# Altium project 开发板.PrjPcb
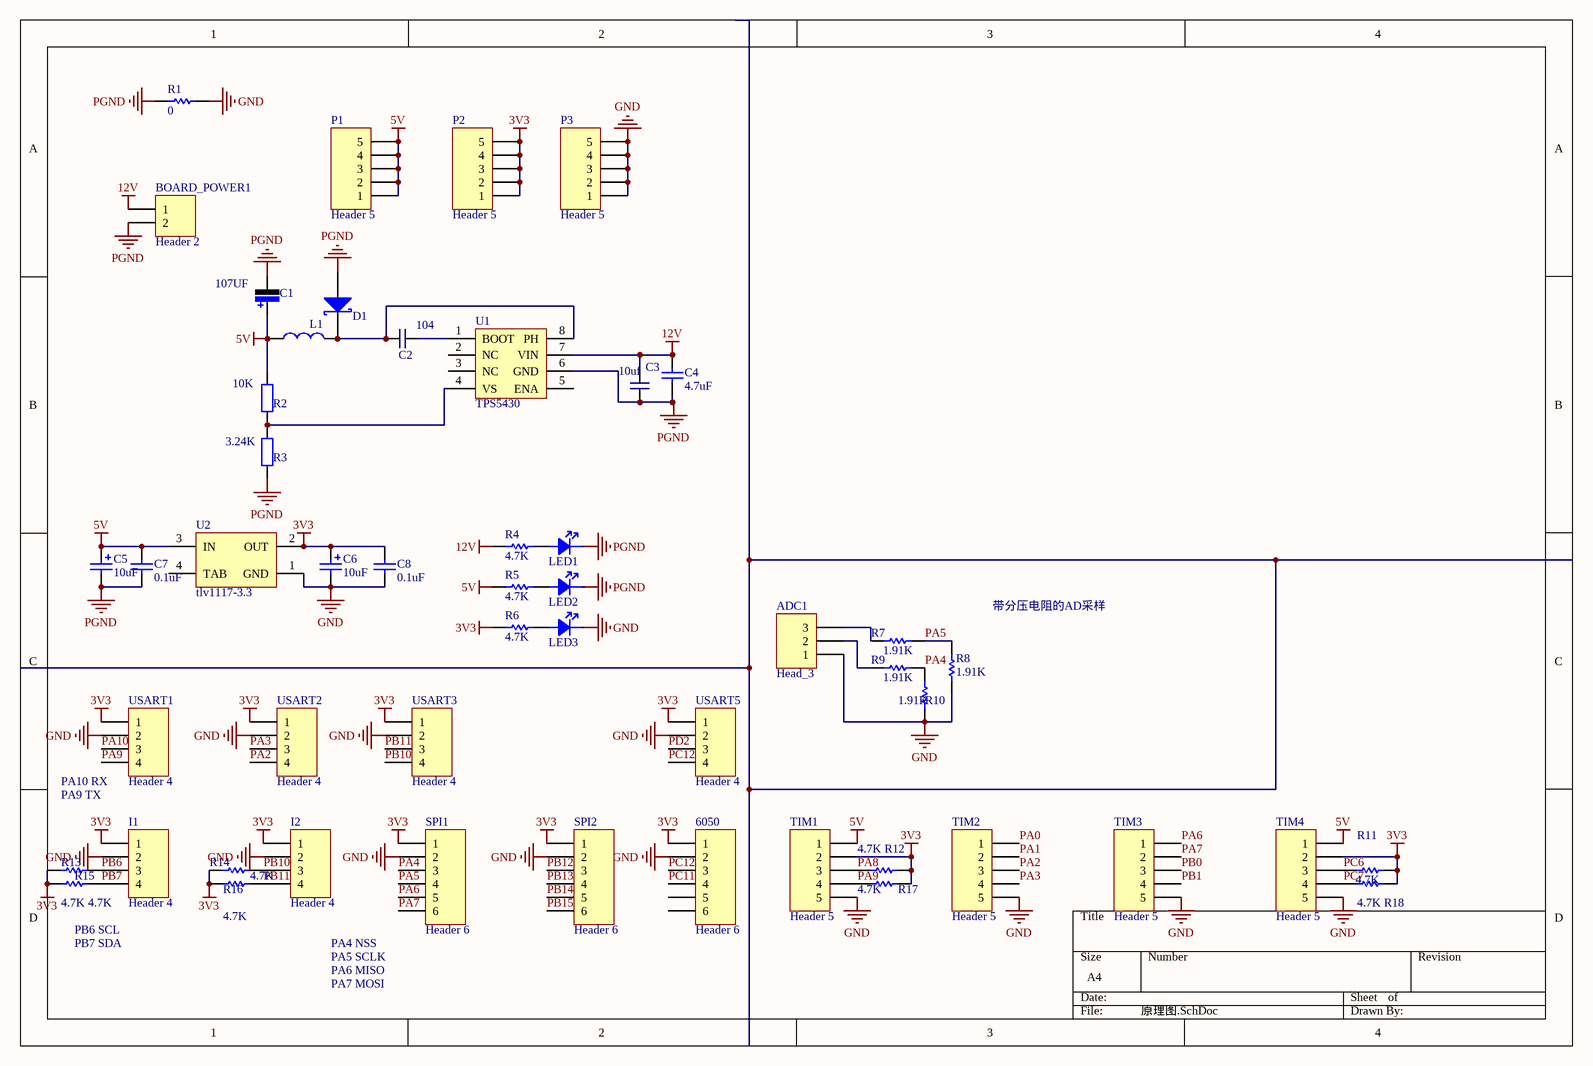
[diagram p0: 原理图.SchDoc]
2 sheets, 71 parts. Net scope: global (net labels, ports and power ports of the same name join across sheets).
Board file: PCB.PcbDoc
Sheets:
  原理图.SchDoc
  最小系统.SchDoc

## Sheet 原理图.SchDoc
size A4

### Parts
6050  Header 6  [HDR1X6- duplicate]
ADC1  Head_3  [HDR1X3]
BOARD_POWER1  Header 2  [Green_2P]
C1  107UF  [6032C  TA]
C2  104  [0603- C]
C3  10uf  [0805C]
C4  value 4.7uF  [CAP-MLCC-0603]  (hidden comment: Cap)
C5  value 10uF  [6032C]  (hidden comment: Cap Pol1)
C6  value 10uF  [6032C]  (hidden comment: Cap Pol1)
C7  value 0.1uF  [CAP-MLCC-0603]  (hidden comment: Cap)
C8  value 0.1uF  [CAP-MLCC-0603]  (hidden comment: Cap)
D1  D  [D RS1M]  (value not drawn)
I1  Header 4  [HDR1X4]
I2  Header 4  [HDR1X4]
L1  L  [CD_54]  (value not drawn)
LED1  lED  [0805D]  (value not drawn)
LED2  lED  [0805D]  (value not drawn)
LED3  lED  [0805D]  (value not drawn)
P1  Header 5  [HDR1X5]
P2  Header 5  [HDR1X5]
P3  Header 5  [HDR1X5]
R1  value 0  [RES-0603]  (hidden comment: Res1)
R2  10K  [0603-R]
R3  3.24K  [0603-R]
R4  value 4.7K  [RES-0603]  (hidden comment: Res1)
R5  value 4.7K  [RES-0603]  (hidden comment: Res1)
R6  value 4.7K  [RES-0603]  (hidden comment: Res1)
R7  value 1.91K  [RES-0603]  (hidden comment: Res1)
R8  value 1.91K  [RES-0603]  (hidden comment: Res1)
R9  value 1.91K  [RES-0603]  (hidden comment: Res1)
R10  value 1.91K  [RES-0603]  (hidden comment: Res1)
R11  value 4.7K  [RES-0603]  (hidden comment: Res1)
R12  value 4.7K  [RES-0603]  (hidden comment: Res1)
R13  value 4.7K  [RES-0603]  (hidden comment: Res1)
R14  value 4.7K  [RES-0603]  (hidden comment: Res1)
R15  value 4.7K  [RES-0603]  (hidden comment: Res1)
R16  value 4.7K  [RES-0603]  (hidden comment: Res1)
R17  value 4.7K  [RES-0603]  (hidden comment: Res1)
R18  value 4.7K  [RES-0603]  (hidden comment: Res1)
SPI1  Header 6  [HDR1X6]
SPI2  Header 6  [HDR1X6]
TIM1  Header 5  [HDR1X5]
TIM2  Header 5  [HDR1X5]
TIM3  Header 5  [HDR1X5]
TIM4  Header 5  [HDR1X5]
U1  TPS5430  [SOIC-8piN]
U2  tlv1117-3.3  [LM1117]
USART1  Header 4  [HDR1X4]
USART2  Header 4  [HDR1X4]
USART3  Header 4  [HDR1X4]
USART5  Header 4  [HDR1X4]

### Nets
3V3: 6050.1 C6.1 C8.2 I1.1 I2.1 P2.1 P2.2 P2.3 P2.4 P2.5 R6.2 R11.1 R12.1 R13.2 R14.2 R15.2 R16.2 R17.1 R18.1 SPI1.1 SPI2.1 TIM1.2 TIM4.2 U2.2(OUT) USART1.1 USART2.1 USART3.1 USART5.1
5V: C1.1 C5.1 C7.2 L1.2 P1.1 P1.2 P1.3 P1.4 P1.5 R2.2 R5.2 TIM1.1 TIM4.1 U2.3(IN)
12V: BOARD_POWER1.1 C3.2 C4.2 R4.2 U1.7(VIN)
GND: 6050.2 ADC1.1 C6.2 C8.1 I1.2 I2.2 LED3.K P3.1 P3.2 P3.3 P3.4 P3.5 R1.2 R8.2 R10.2 SPI1.2 SPI2.2 TIM1.5 TIM2.5 TIM3.5 TIM4.5 U2.1(GND) USART1.2 USART2.2 USART3.2 USART5.2
PGND: BOARD_POWER1.2 C1.2 C3.1 C4.1 C5.2 C7.1 D1.A LED1.K LED2.K R1.1 R3.2 U1.6(GND)
PA0: TIM2.1
PA1: TIM2.2
PA2: TIM2.3 USART2.4
PA3: TIM2.4 USART2.3
PA4: R9.1 R10.1 SPI1.3
PA5: R7.1 R8.1 SPI1.4
PA6: SPI1.5 TIM3.1
PA7: SPI1.6 TIM3.2
PA8: R12.2 TIM1.3
PA9: R17.2 TIM1.4 USART1.4
PA10: USART1.3
PB0: TIM3.3
PB1: TIM3.4
PB6: I1.3 R13.1
PB7: I1.4 R15.1
PB10: I2.3 R14.1 USART3.4
PB11: I2.4 R16.1 USART3.3
PB12: SPI2.3
PB13: SPI2.4
PB14: SPI2.5
PB15: SPI2.6
PC6: R11.2 TIM4.3
PC7: R18.2 TIM4.4
PC11: 6050.4
PC12: 6050.3 USART5.4
PD2: USART5.3
NetADC1_2: ADC1.2 R9.2
NetADC1_3: ADC1.3 R7.2
NetC2_1: C2.1 U1.1(BOOT)
NetC2_2: C2.2 D1.K L1.1 U1.8(PH)
NetLED1_A: LED1.A R4.1
NetLED2_A: LED2.A R5.1
NetLED3_A: LED3.A R6.1
NetR2_1: R2.1 R3.1 U1.4(VS)

Not connected (* = marked no-connect by the designer): 6050 5 6; U1 2(NC) 3(NC) 5(ENA); U2 4(TAB)

### Notes on the sheet
- 带分压电阻的AD采样
- (near USART1) PA10 RX
- PA9 TX
- PB6 SCL
- PB7 SDA
- PA4 NSS
- PA5 SCLK
- PA6 MISO
- PA7 MOSI

### Library data of the parts
6050 = Header 6: 接插件; LatestRevisionDate: 17-Jul-2002; LatestRevisionNote: Re-released for DXP Platform.; Publisher: Altium Limited
BOARD_POWER1 = Header 2: Header, 2-Pin; LatestRevisionDate: 17-Jul-2002; LatestRevisionNote: Re-released for DXP Platform.; Publisher: Altium Limited
C1 = Cap_2: 钽电容
C2 C3 = Cap
C4 C7 C8 = Cap: Capacitor; Published: 8-Jun-2000; LatestRevisionDate: 17-Jul-2002; LatestRevisionNote: Re-released for DXP Platform.; PackageReference: RAD-0.3; Publisher: Altium Limited
C5 C6 = Cap Pol1: Polarized Capacitor (Radial); Published: 8-Jun-2000; LatestRevisionDate: 17-Jul-2002; LatestRevisionNote: Re-released for DXP Platform.; PackageReference: RB7.6-15; Publisher: Altium Limited
I1 I2 USART1-USART3 USART5 = Header 4: Header, 4-Pin; LatestRevisionDate: 17-Jul-2002; LatestRevisionNote: Re-released for DXP Platform.; Publisher: Altium Limited
L1 = L: 电感
LED1-LED3 = 00-D-LED
P1-P3 TIM1-TIM4 = Header 5: Header, 5-Pin; LatestRevisionDate: 17-Jul-2002; LatestRevisionNote: Re-released for DXP Platform.; Publisher: Altium Limited
R1 R4-R18 = Res1: Resistor; Published: 8-Jun-2000; LatestRevisionDate: 17-Jul-2002; LatestRevisionNote: Re-released for DXP Platform.; PackageReference: AXIAL-0.3; Publisher: Altium Limited
R2 R3 = R
SPI1 SPI2 = Header 6: Header, 6-Pin; LatestRevisionDate: 17-Jul-2002; LatestRevisionNote: Re-released for DXP Platform.; Publisher: Altium Limited
U2 = LM1117IMP-5.0: 800mA Low-Dropout Linear Regulator; Manufacturer: National Semiconductor; CompType: LDO IC; PackageTopMarking: XYTT*N06B; PowerWise: N; Published: 4-Dec-2008; DatasheetVersion: Apr-2006; PackageVersion: revB, Apr-2003; PackageReference: MP04A; Publisher: Altium Limited; PackageDescription: Molded SOT-223, 6.50 x 3.56 x 1.6mm Body, 4 Lead, 2.3mm Pitch; PartNumber: LM1117IMP-5.0; RoHS: O; PinCount: 4; DigiKeyPartNumber: LM1117IMP-5.0CT-ND; Code_JEDEC: TO-261-AA; Code_IPC: SOT223-4; ComponentLink1Description: LM1117 Datasheet; ComponentLink1URL: http://www.national.com/ds/LM/LM1117.pdf; ComponentLink2Description: LM1117 Web Page; ComponentLink2URL: http://www.national.com/pf/LM/LM1117.html; ComponentLink3Description: MP04A Package Page; ComponentLink3URL: http://www.national.com/packaging/folders/mp04a.html

## Sheet 最小系统.SchDoc
size A4
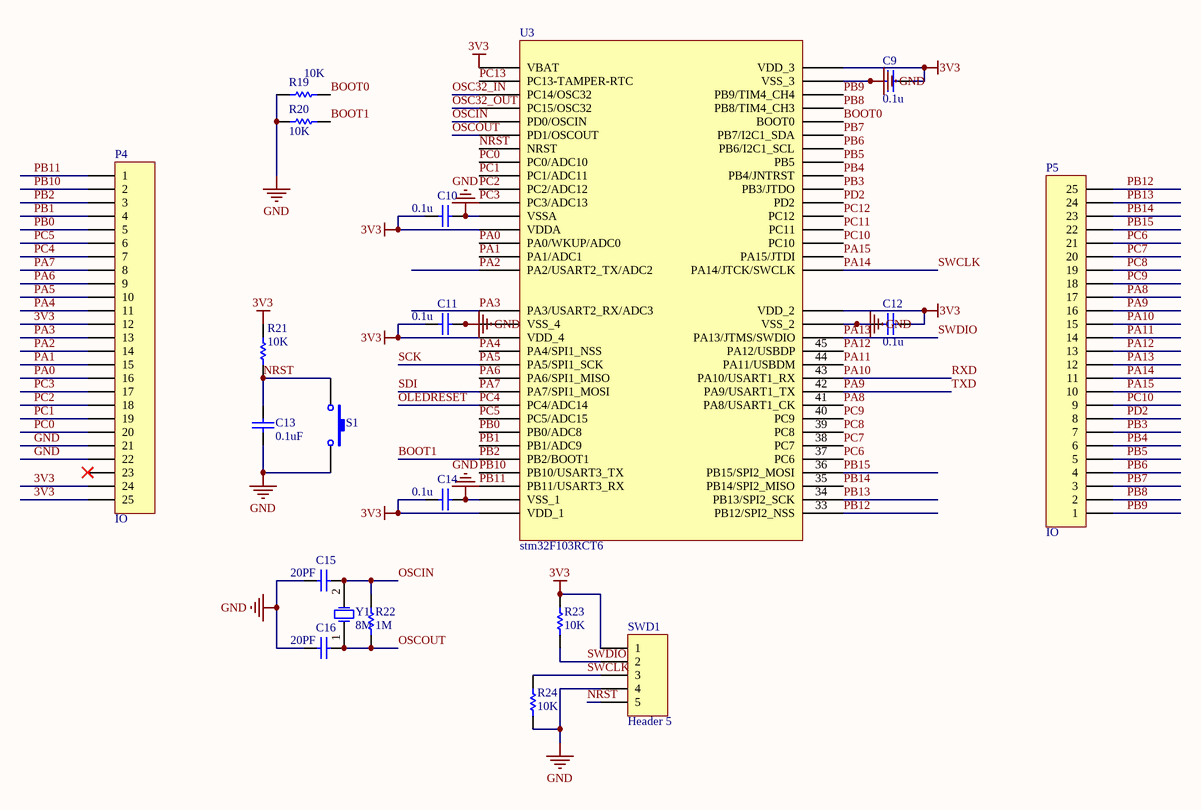
[diagram p1: 最小系统.SchDoc]

### Parts
C9  value 0.1u  [CAP-MLCC-0603]  (hidden comment: Cap)
C10  value 0.1u  [CAP-MLCC-0603]  (hidden comment: Cap)
C11  value 0.1u  [CAP-MLCC-0603]  (hidden comment: Cap)
C12  value 0.1u  [CAP-MLCC-0603]  (hidden comment: Cap)
C13  value 0.1uF  [CAP-MLCC-0603]  (hidden comment: Cap)
C14  value 0.1u  [CAP-MLCC-0603]  (hidden comment: Cap)
C15  value 20PF  [CAP-MLCC-0603]  (hidden comment: Cap)
C16  value 20PF  [CAP-MLCC-0603]  (hidden comment: Cap)
P4  IO  [Header 25]
P5  IO  [Header 25]
R19  value 10K  [RES-0603]  (hidden comment: Res1)
R20  value 10K  [RES-0603]  (hidden comment: Res1)
R21  value 10K  [RES-0603]  (hidden comment: Res1)
R22  value 1M  [RES-0603]  (hidden comment: Res1)
R23  value 10K  [RES-0603]  (hidden comment: Res1)
R24  value 10K  [RES-0603]  (hidden comment: Res1)
S1  SW-PB  [key - duplicate]  (value not drawn)
SWD1  Header 5  [HDR1X5]
U3  stm32F103RCT6  [STM32F103RCT6]
Y1  8M  [Osc-6032]

### Nets
3V3: C9.1 C10.1 C11.1 C12.1 C14.1 P4.12 P4.24 P4.25 R21.2 R23.2 SWD1.1 U3.1(VBAT) U3.13(VDDA) U3.19(VDD_4) U3.32(VDD_1) U3.48(VDD_2) U3.64(VDD_3)
GND: C9.2 C10.2 C11.2 C12.2 C13.2 C14.2 C15.1 C16.1 P4.21 P4.22 R19.2 R20.2 R24.2 S1.2 SWD1.4 U3.12(VSSA) U3.18(VSS_4) U3.31(VSS_1) U3.47(VSS_2) U3.63(VSS_3)
BOOT0: R19.1 U3.60(BOOT0)
BOOT1: P4.3 R20.1 U3.28(PB2/BOOT1)  [also labelled PB2]
NRST: C13.1 R21.1 S1.1 SWD1.5 U3.7(NRST)
OLEDRESET: P4.7 U3.24(PC4/ADC14)  [also labelled PC4]
OSC32_IN: U3.3(PC14/OSC32)
OSC32_OUT: U3.4(PC15/OSC32)
OSCIN: C15.2 R22.2 U3.5(PD0/OSCIN) Y1.2(OSC2)
OSCOUT: C16.2 R22.1 U3.6(PD1/OSCOUT) Y1.1(OSC1)
PA0: P4.16 U3.14(PA0/WKUP/ADC0)
PA1: P4.15 U3.15(PA1/ADC1)
PA2: P4.14 U3.16(PA2/USART2_TX/ADC2)
PA3: P4.13 U3.17(PA3/USART2_RX/ADC3)
PA4: P4.11 U3.20(PA4/SPI1_NSS)
PA5: P4.10 U3.21(PA5/SPI1_SCK)  [also labelled SCK]
PA6: P4.9 U3.22(PA6/SPI1_MISO)
PA7: P4.8 U3.23(PA7/SPI1_MOSI)  [also labelled SDI]
PA8: P5.17 U3.41(PA8/USART1_CK)
PA9: P5.16 U3.42(PA9/USART1_TX)  [also labelled TXD]
PA10: P5.15 U3.43(PA10/USART1_RX)  [also labelled RXD]
PA11: P5.14 U3.44(PA11/USBDM)
PA12: P5.13 U3.45(PA12/USBDP)
PA13: P5.12 R23.1 SWD1.2 U3.46(PA13/JTMS/SWDIO)  [also labelled SWDIO]
PA14: P5.11 R24.1 SWD1.3 U3.49(PA14/JTCK/SWCLK)  [also labelled SWCLK]
PA15: P5.10 U3.50(PA15/JTDI)
PB0: P4.5 U3.26(PB0/ADC8)
PB1: P4.4 U3.27(PB1/ADC9)
PB3: P5.7 U3.55(PB3/JTDO)
PB4: P5.6 U3.56(PB4/JNTRST)
PB5: P5.5 U3.57(PB5)
PB6: P5.4 U3.58(PB6/I2C1_SCL)
PB7: P5.3 U3.59(PB7/I2C1_SDA)
PB8: P5.2 U3.61(PB8/TIM4_CH3)
PB9: P5.1 U3.62(PB9/TIM4_CH4)
PB10: P4.2 U3.29(PB10/USART3_TX)
PB11: P4.1 U3.30(PB11/USART3_RX)
PB12: P5.25 U3.33(PB12/SPI2_NSS)
PB13: P5.24 U3.34(PB13/SPI2_SCK)
PB14: P5.23 U3.35(PB14/SPI2_MISO)
PB15: P5.22 U3.36(PB15/SPI2_MOSI)
PC0: P4.20 U3.8(PC0/ADC10)
PC1: P4.19 U3.9(PC1/ADC11)
PC2: P4.18 U3.10(PC2/ADC12)
PC3: P4.17 U3.11(PC3/ADC13)
PC5: P4.6 U3.25(PC5/ADC15)
PC6: P5.21 U3.37(PC6)
PC7: P5.20 U3.38(PC7)
PC8: P5.19 U3.39(PC8)
PC9: P5.18 U3.40(PC9)
PC10: P5.9 U3.51(PC10)
PC11: U3.52(PC11)
PC12: U3.53(PC12)
PC13: U3.2(PC13-TAMPER-RTC)
PD2: P5.8 U3.54(PD2)

Not connected (* = marked no-connect by the designer): P4 23*

### Library data of the parts
C9-C12 C14-C16 = Cap_1: Capacitor; Published: 8-Jun-2000; LatestRevisionDate: 17-Jul-2002; LatestRevisionNote: Re-released for DXP Platform.; PackageReference: RAD-0.3; Publisher: Altium Limited
C13 = Cap: Capacitor; Published: 8-Jun-2000; LatestRevisionDate: 17-Jul-2002; LatestRevisionNote: Re-released for DXP Platform.; PackageReference: RAD-0.3; Publisher: Altium Limited
P4 P5 = Header 25: Header, 25-Pin; LatestRevisionDate: 17-Jul-2002; LatestRevisionNote: Re-released for DXP Platform.; Publisher: Altium Limited
R19-R24 = Res1_1: Resistor; Published: 8-Jun-2000; LatestRevisionDate: 17-Jul-2002; LatestRevisionNote: Re-released for DXP Platform.; PackageReference: AXIAL-0.3; Publisher: Altium Limited
S1 = SW-PB: Switch; Published: 24-Mar-1999; LatestRevisionDate: 17-Jul-2002; LatestRevisionNote: Re-released for DXP Platform.; PackageReference: SPST-2; Publisher: Altium Limited; PackageDescription: Switch; 2 Leads
SWD1 = Header 5: Header, 5-Pin; LatestRevisionDate: 17-Jul-2002; LatestRevisionNote: Re-released for DXP Platform.; Publisher: Altium Limited
Y1 = C-Osc: Crystal Oscillator; Published: 8-Jun-2000; LatestRevisionDate: 17-Jul-2002; LatestRevisionNote: Re-released for DXP Platform.; PackageReference: R38; Publisher: Altium Limited; PackageDescription: Crystal, Thru-Hole; 2 Leads; Body 3.1 x 8.2 mm (Dia.xH)

## Nets that join several sheets
3V3: 原理图 (28 pins), 最小系统 (17 pins)
GND: 原理图 (26 pins), 最小系统 (20 pins)
PA0: 原理图 (TIM2.1), 最小系统 (P4.16 U3.14)
PA1: 原理图 (TIM2.2), 最小系统 (P4.15 U3.15)
PA2: 原理图 (TIM2.3 USART2.4), 最小系统 (P4.14 U3.16)
PA3: 原理图 (TIM2.4 USART2.3), 最小系统 (P4.13 U3.17)
PA4: 原理图 (R9.1 R10.1 SPI1.3), 最小系统 (P4.11 U3.20)
PA5: 原理图 (R7.1 R8.1 SPI1.4), 最小系统 (P4.10 U3.21)
PA6: 原理图 (SPI1.5 TIM3.1), 最小系统 (P4.9 U3.22)
PA7: 原理图 (SPI1.6 TIM3.2), 最小系统 (P4.8 U3.23)
PA8: 原理图 (R12.2 TIM1.3), 最小系统 (P5.17 U3.41)
PA9: 原理图 (R17.2 TIM1.4 USART1.4), 最小系统 (P5.16 U3.42)
PA10: 原理图 (USART1.3), 最小系统 (P5.15 U3.43)
PB0: 原理图 (TIM3.3), 最小系统 (P4.5 U3.26)
PB1: 原理图 (TIM3.4), 最小系统 (P4.4 U3.27)
PB6: 原理图 (I1.3 R13.1), 最小系统 (P5.4 U3.58)
PB7: 原理图 (I1.4 R15.1), 最小系统 (P5.3 U3.59)
PB10: 原理图 (I2.3 R14.1 USART3.4), 最小系统 (P4.2 U3.29)
PB11: 原理图 (I2.4 R16.1 USART3.3), 最小系统 (P4.1 U3.30)
PB12: 原理图 (SPI2.3), 最小系统 (P5.25 U3.33)
PB13: 原理图 (SPI2.4), 最小系统 (P5.24 U3.34)
PB14: 原理图 (SPI2.5), 最小系统 (P5.23 U3.35)
PB15: 原理图 (SPI2.6), 最小系统 (P5.22 U3.36)
PC6: 原理图 (R11.2 TIM4.3), 最小系统 (P5.21 U3.37)
PC7: 原理图 (R18.2 TIM4.4), 最小系统 (P5.20 U3.38)
PC11: 原理图 (6050.4), 最小系统 (U3.52)
PC12: 原理图 (6050.3 USART5.4), 最小系统 (U3.53)
PD2: 原理图 (USART5.3), 最小系统 (P5.8 U3.54)